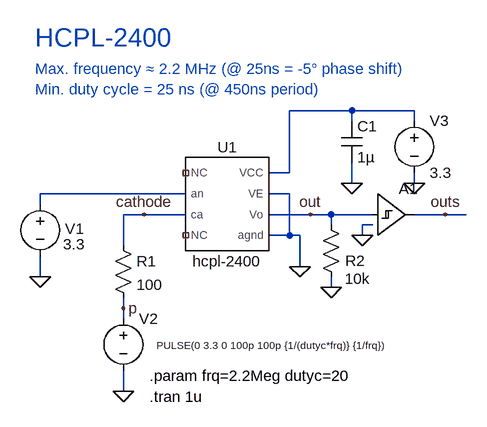
[diagram p0: schematic 02-hcpl2400.asc]
02-hcpl2400.asc, the LTspice schematic file:
Version 4
SHEET 1 880 680
WIRE 448 0 352 0
WIRE 544 0 448 0
WIRE 448 16 448 0
WIRE 544 16 544 0
WIRE 352 96 352 0
WIRE 352 96 320 96
WIRE 448 112 448 80
WIRE 544 112 544 96
WIRE 192 128 -32 128
WIRE 352 128 320 128
WIRE -32 144 -32 128
WIRE 128 160 96 160
WIRE 192 160 128 160
WIRE 384 160 320 160
WIRE 416 160 384 160
WIRE 480 160 416 160
WIRE 592 160 544 160
WIRE 624 160 592 160
WIRE 416 176 416 160
WIRE 480 176 464 176
WIRE 352 192 352 128
WIRE 352 192 320 192
WIRE 368 192 352 192
WIRE 464 192 464 176
WIRE 96 208 96 160
WIRE 368 240 368 192
WIRE -32 256 -32 224
WIRE 416 272 416 256
WIRE 96 304 96 288
WIRE 96 320 96 304
WIRE 96 432 96 400
FLAG -32 256 0
FLAG 96 432 0
FLAG 384 160 out
FLAG 368 240 0
FLAG 544 112 0
FLAG 128 160 cathode
FLAG 96 304 p
FLAG 448 112 0
FLAG 416 272 0
FLAG 464 192 0
FLAG 592 160 outs
SYMBOL res 80 192 R0
SYMATTR InstName R1
SYMATTR Value 100
SYMBOL voltage -32 128 R0
WINDOW 0 38 54 Left 2
WINDOW 3 35 78 Left 2
WINDOW 123 0 0 Left 0
WINDOW 39 0 0 Left 0
SYMATTR InstName V1
SYMATTR Value 3.3
SYMBOL voltage 96 304 R0
WINDOW 123 0 0 Left 0
WINDOW 39 0 0 Left 0
WINDOW 3 51 57 Left 1
SYMATTR Value PULSE(0 3.3 0 100p 100p {1/(dutyc*frq)} {1/frq})
SYMATTR InstName V2
SYMBOL voltage 544 0 R0
WINDOW 123 0 0 Left 0
WINDOW 39 0 0 Left 0
SYMATTR InstName V3
SYMATTR Value 3.3
SYMBOL hcpl-2400 256 144 R0
SYMATTR InstName U1
SYMBOL cap 432 16 R0
SYMATTR InstName C1
SYMATTR Value 1µ
SYMATTR SpiceLine V=16 Irms=0 Rser=0 Lser=0 mfg="Murata" pn="GCM188R71C105MA64" type="X7R"
SYMBOL res 400 160 R0
WINDOW 0 38 71 Left 2
WINDOW 3 37 99 Left 2
SYMATTR InstName R2
SYMATTR Value 10k
SYMBOL Digital\\schmtbuf 480 96 R0
SYMATTR InstName A1
TEXT 136 408 Left 2 !.param frq=2.2Meg dutyc=20
TEXT 136 440 Left 2 !.tran 1u
TEXT -40 -64 Left 2 ;Max. frequency ≈ 2.2 MHz (@ 25ns = -5° phase shift)\nMin. duty cycle = 25 ns (@ 450ns period)
TEXT -40 -112 Left 4 ;HCPL-2400

The netlist it stands for:
* 02-hcpl2400.asc
R1 cathode p 100
V1 N002 0 3.3
V2 p 0 PULSE(0 3.3 0 100p 100p {1/(dutyc*frq)} {1/frq})
V3 N001 0 3.3
XU1 NC_01 N002 cathode NC_02 0 out 0 N001 hcpl-2400  ; pins NC an ca NC agnd Vo VE VCC
C1 N001 0 1µ V=16 Irms=0 Rser=0 Lser=0 mfg="Murata" pn="GCM188R71C105MA64" type="X7R"
R2 out 0 10k
A1 out 0 0 0 0 0 outs 0 SCHMITT
.param frq=2.2Meg dutyc=20
.tran 1u
* Max. frequency ≈ 2.2 MHz (@ 25ns = -5° phase shift)
* Min. duty cycle = 25 ns (@ 450ns period)
* HCPL-2400
.lib C:\Users\hop\Documents\GitHub\LTspice\01-lib\HCPL2400.mod
.backanno
.end